# Altium schematic sheet INA219-surrounding.SchDoc
size A4; SheetNumber: 2; SheetTotal: 2
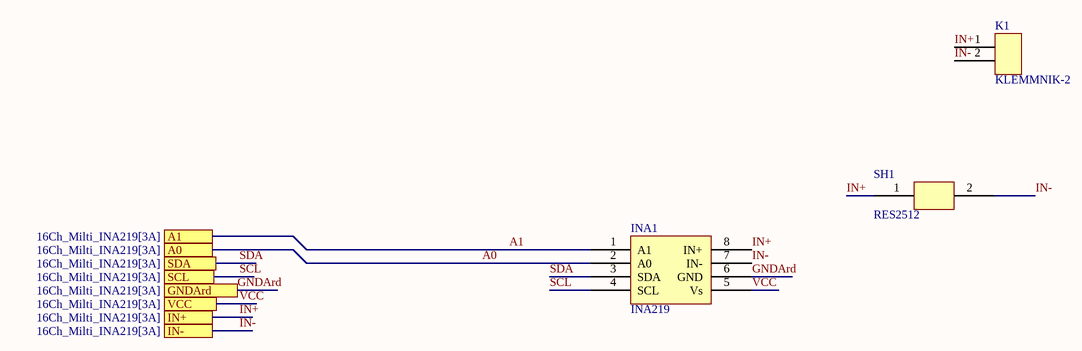
[diagram p0: INA219-surrounding.SchDoc]

## Parts
INA1  INA219  [INA219]
K1  KLEMMNIK-2  [KLEMMNIK-2]
SH1  RES2512  [RES2512]

## Ports
A0 (see 16Ch_Milti_INA219[3A]), A1 (see 16Ch_Milti_INA219[3A]), GNDArd (see 16Ch_Milti_INA219[3A]), IN+ (see 16Ch_Milti_INA219[3A]), IN- (see 16Ch_Milti_INA219[3A]), SCL (see 16Ch_Milti_INA219[3A]), SDA (see 16Ch_Milti_INA219[3A]), VCC (see 16Ch_Milti_INA219[3A])

## Nets
A0: INA1.2(A0) ; port A0
A1: INA1.1(A1) ; port A1
GNDArd: INA1.6(GND) ; port GNDArd
IN+: INA1.8(IN+) K1.1 SH1.1 ; port IN+
IN-: INA1.7(IN-) K1.2 SH1.2 ; port IN-
SCL: INA1.4(SCL) ; port SCL
SDA: INA1.3(SDA) ; port SDA
VCC: INA1.5(Vs) ; port VCC